# EAGLE design USBhost (EAGLE 5.11)
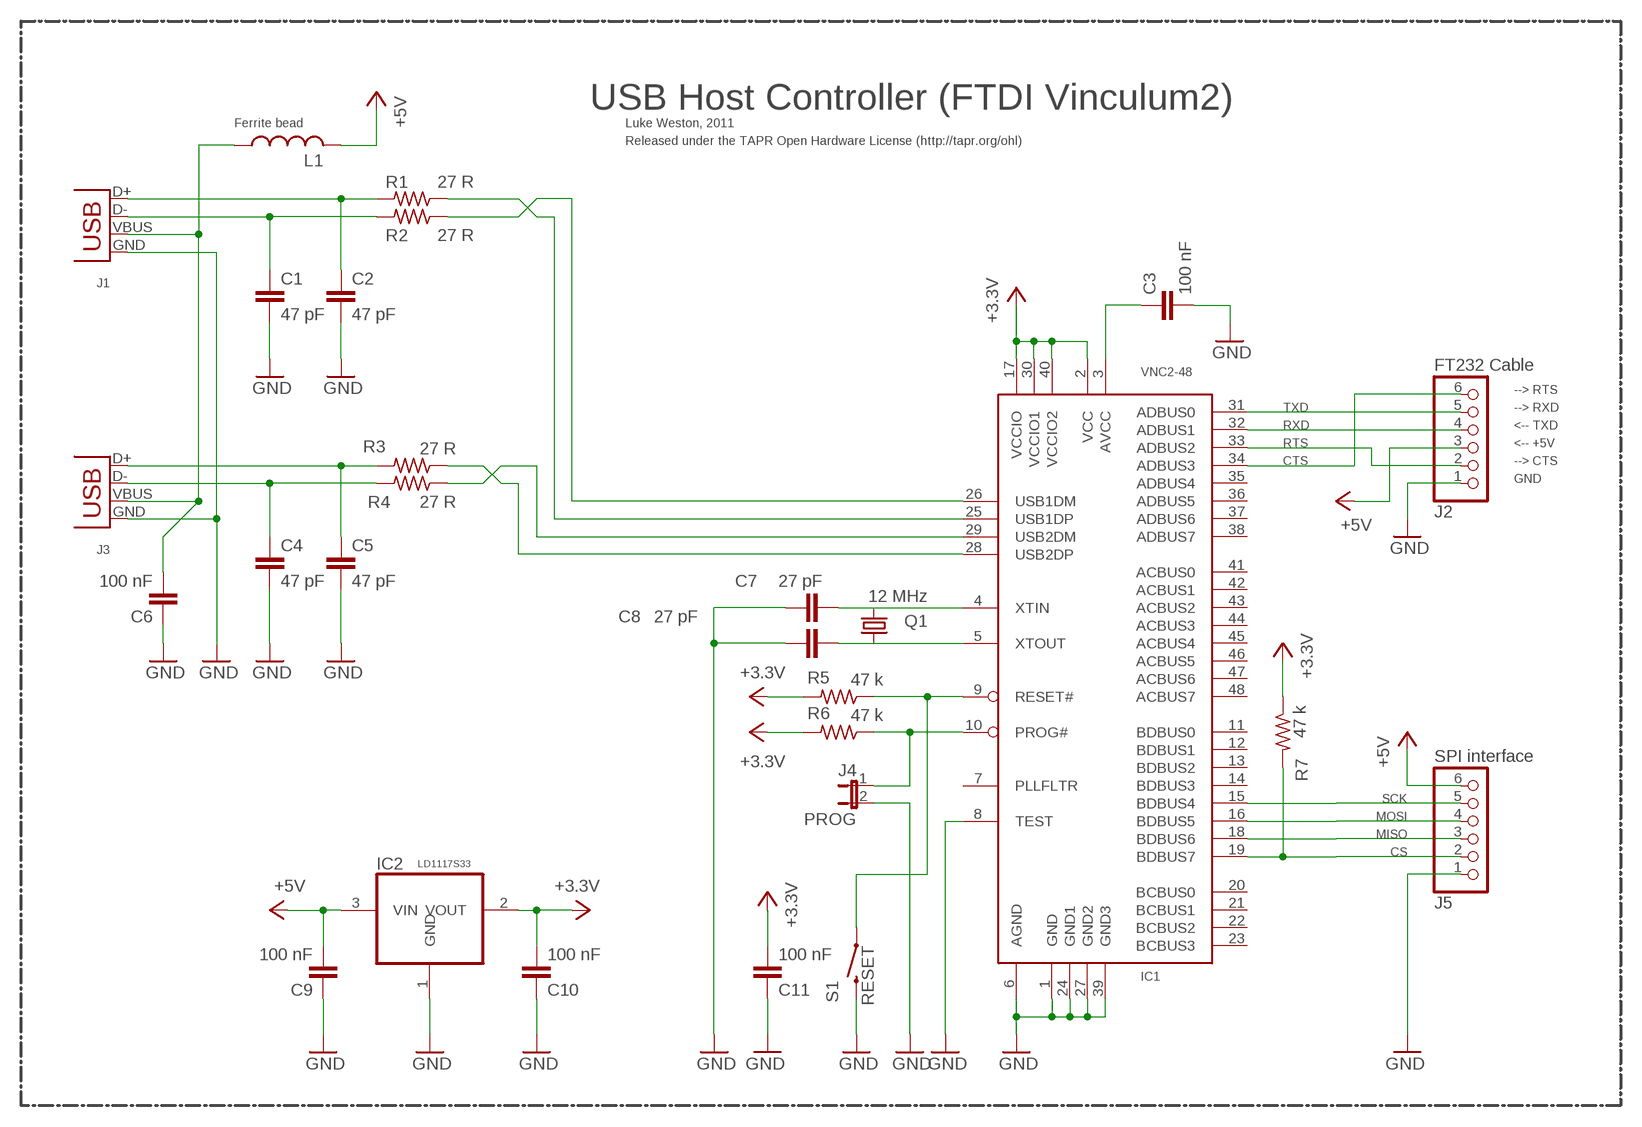
[diagram p0: schematic, sheet 1]

## Parts
C1  47 pF  C-EU025-024X044  [C025-024X044]
C2  47 pF  C-EU025-024X044  [C025-024X044]
C3  100 nF  C-EU025-024X044  [C025-024X044]
C4  47 pF  C-EU025-024X044  [C025-024X044]
C5  47 pF  C-EU025-024X044  [C025-024X044]
C6  100 nF  C-EU025-024X044  [C025-024X044]
C7  27 pF  C-EU025-024X044  [C025-024X044]
C8  27 pF  C-EU025-024X044  [C025-024X044]
C9  100 nF  C-EU025-024X044  [C025-024X044]
C10  100 nF  C-EU025-024X044  [C025-024X044]
C11  100 nF  C-EU025-024X044  [C025-024X044]
IC1  VNC2-48  VNC1L-1A  [LQFP48]
IC2  LD1117S33  REG1117  [SOT223]
J1  609-1041-ND  USB-A-HU  [USB-A-HU]
J2  FT232 Cable  PINHD-1X6  [1X06]
J3  609-1041-ND  USB-A-HU  [USB-A-HU]
J4  PROG  JP1E  [JP1]
J5  SPI interface  PINHD-1X6  [1X06]
L1  L-US0204/7  [0204/7]
Q1  12 MHz  CRYSTALHC49S  [HC49/S]
R1  27 R  R-US_0207/10  [0207/10]
R2  27 R  R-US_0207/10  [0207/10]
R3  27 R  R-US_0207/10  [0207/10]
R4  27 R  R-US_0207/10  [0207/10]
R5  47 k  R-US_0207/10  [0207/10]
R6  47 k  R-US_0207/10  [0207/10]
R7  47 k  R-US_0207/10  [0207/10]
S1  RESET  SWITCH-MOMENTARY-2PTH  [TACTILE-PTH]

## Nets
+3V3: C10.2 C11.2 IC1.2(VCC) IC1.17(VCCIO) IC1.30(VCCIO1) IC1.40(VCCIO2) IC2.2(VOUT) R5.2 R6.2 R7.1 ; supply symbol labelled +3.3V
+5V: C9.2 IC2.3(VIN) J2.3 J5.6 L1.2
/RESET: IC1.9(RESET#) R5.1 S1.1
/VNC_PROG: IC1.10(PROG#) J4.1 R6.1
CS: IC1.19(BDBUS7) J5.2 R7.2
CTS: IC1.34(ADBUS3) J2.6
GND: C1.2 C2.2 C3.2 C4.2 C5.2 C6.1 C7.2 C8.2 C9.1 C10.1 C11.1 IC1.1(GND) IC1.6(AGND) IC1.8(TEST) IC1.24(GND1) IC1.27(GND2) IC1.39(GND3) IC2.1(GND) J1.GND J2.1 J3.GND J4.2 J5.1 S1.3
MISO: IC1.18(BDBUS6) J5.3
MOSI: IC1.16(BDBUS5) J5.4
N$1: C3.1 IC1.3(AVCC)
N$2: C1.1 J1.D- R2.2
N$4: C2.1 J1.D+ R1.2
N$18: C4.1 J3.D- R4.2
N$19: C5.1 J3.D+ R3.2
N$22: IC1.29(USB2DM) R4.1
N$24: IC1.28(USB2DP) R3.1
N$25: IC1.25(USB1DP) R1.1
N$26: IC1.26(USB1DM) R2.1
N$44: C7.1 IC1.4(XTIN) Q1.2
N$45: C8.1 IC1.5(XTOUT) Q1.1
N$125: C6.2 J1.VBUS J3.VBUS L1.1
RTS: IC1.33(ADBUS2) J2.2
RXD: IC1.32(ADBUS1) J2.4
SCK: IC1.15(BDBUS4) J5.5
TXD: IC1.31(ADBUS0) J2.5
Unconnected: IC1.7(PLLFLTR) IC1.11(BDBUS0) IC1.12(BDBUS1) IC1.13(BDBUS2) IC1.14(BDBUS3) IC1.20(BCBUS0) IC1.21(BCBUS1) IC1.22(BCBUS2) IC1.23(BCBUS3) IC1.35(ADBUS4) IC1.36(ADBUS5) IC1.37(ADBUS6) IC1.38(ADBUS7) IC1.41(ACBUS0) IC1.42(ACBUS1) IC1.43(ACBUS2) IC1.44(ACBUS3) IC1.45(ACBUS4) IC1.46(ACBUS5) IC1.47(ACBUS6) IC1.48(ACBUS7)

## Notes on the sheet
- USB Host Controller (FTDI Vinculum2)
- Ferrite bead | Luke Weston, 2011
- Released under the TAPR Open Hardware License (http://tapr.org/ohl)
- --> RTS
- --> RXD
- <-- TXD
- <-- +5V
- --> CTS
- GND

## Library data of the parts
C1-C11 = rcl:C-EU: CAPACITOR, European symbol
IC1 = ftdichip-1:VNC1L
IC2 = burr-brown:REG1117: 800mA and 1A Low Dropout (LDO) Positive Regulator 1.8V, 2.5V, 2.85V, 3.3V, 5V, and Adj; MPN: REG1117; OC_FARNELL: 1097566; OC_NEWARK: 14P6981
J1 J3 = con-usb-3:USB: USB Connectors
J2 J5 = pinhead:PINHD-1X6: PIN HEADER
J4 = jumper:JP1E: JUMPER
L1 = rcl:L-US: INDUCTOR, American symbol
Q1 = crystal:CRYSTAL: CRYSTAL
R1-R7 = rcl:R-US_: RESISTOR, American symbol
S1 = SparkFun:SWITCH-MOMENTARY-2

## Board
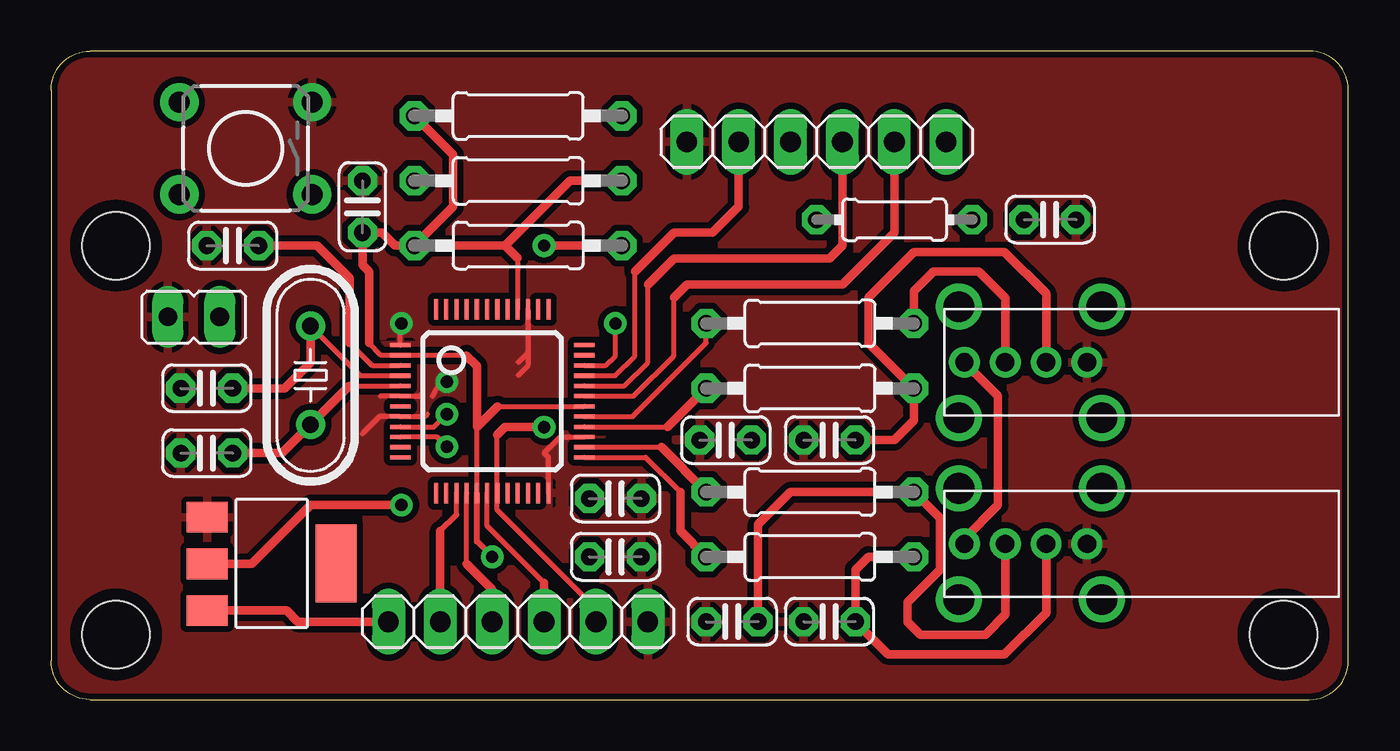
[diagram p1: board, top side]
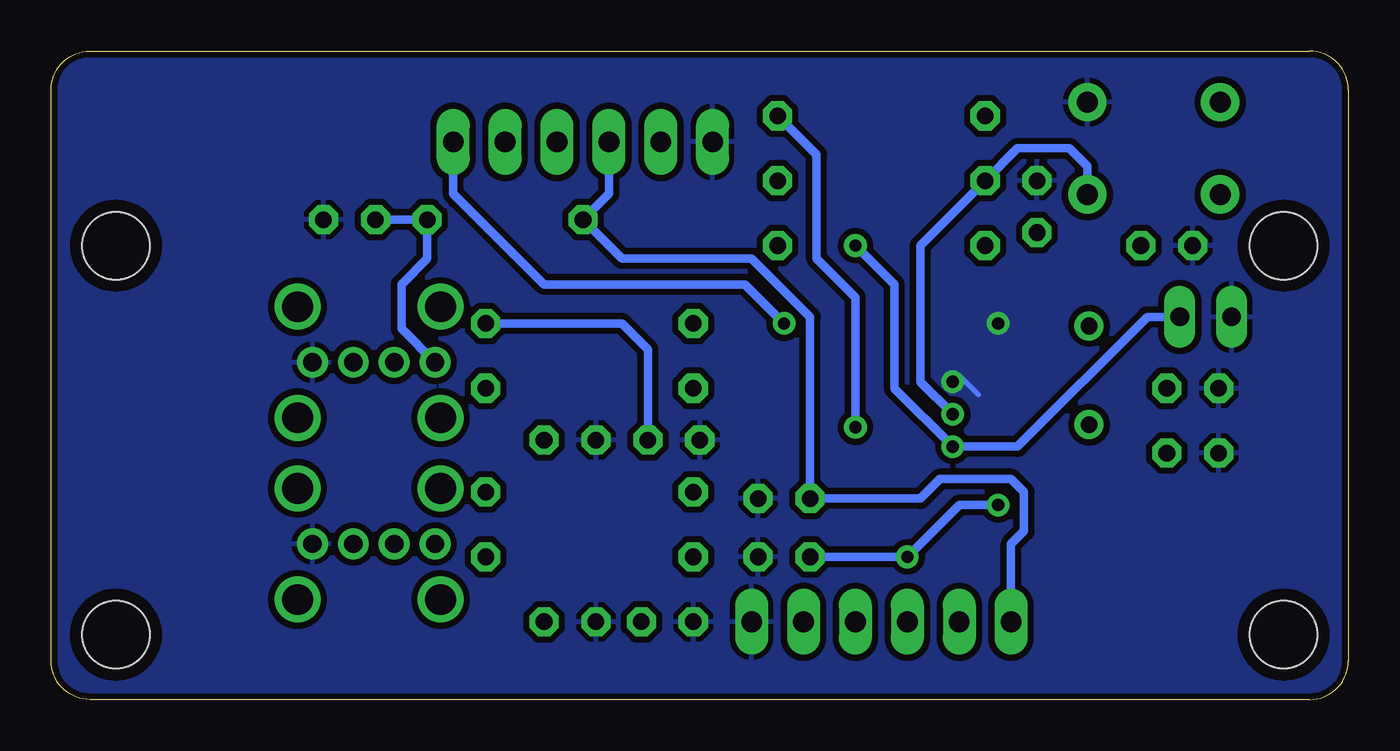
[diagram p2: board, bottom side, seen from below]

Size 63.5 x 31.75 mm. Coordinates in mm from the lower left corner, seen from the top.
Outline: 1.91,0 61.59,0 arc90 63.5,1.91 63.5,29.84 arc90 61.59,31.75 1.91,31.75 arc90 0,29.84 0,1.91 arc90 1.91,0
Copper layers (1*16): Top 0.035mm / dielectric 1.5mm / Bottom 0.035mm
Design rules "SparkFun.drc *": minimum track width 7mil, minimum drill 20mil, track to track 8mil, track to pad 8mil, pad to pad 8mil, via to via 8mil, smd to smd 8mil, copper to edge 10mil, drill to drill 8mil, minimum pad ring 12mil, minimum via ring 10mil, stop-mask expansion 4mil, vias tented up to drill 25mil, thermal gap 10mil

### Footprints (pad centres in the part's own frame; a part is rotated, then mirrored left to right if it is on the bottom)
C025-024X044 = drill 0.813 octagon: 1 -1.27,0; 2 1.27,0
LQFP48 = smd 0.2 x 1: 1 -2.75,-4.5; 2 -2.25,-4.5; 3 -1.75,-4.5; 4 -1.25,-4.5; 5 -0.75,-4.5; 6 -0.25,-4.5; 7 0.25,-4.5; 8 0.75,-4.5; 9 1.25,-4.5; 10 1.75,-4.5; 11 2.25,-4.5; 12 2.75,-4.5; 25 2.75,4.5; 26 2.25,4.5; 27 1.75,4.5; 28 1.25,4.5; 29 0.75,4.5; 30 0.25,4.5; 31 -0.25,4.5; 32 -0.75,4.5; 33 -1.25,4.5; 34 -1.75,4.5; 35 -2.25,4.5; 36 -2.75,4.5 | smd 1 x 0.2: 13 4.5,-2.75; 14 4.5,-2.25; 15 4.5,-1.75; 16 4.5,-1.25; 17 4.5,-0.75; 18 4.5,-0.25; 19 4.5,0.25; 20 4.5,0.75; 21 4.5,1.25; 22 4.5,1.75; 23 4.5,2.25; 24 4.5,2.75; 37 -4.5,2.75; 38 -4.5,2.25; 39 -4.5,1.75; 40 -4.5,1.25; 41 -4.5,0.75; 42 -4.5,0.25; 43 -4.5,-0.25; 44 -4.5,-0.75; 45 -4.5,-1.25; 46 -4.5,-1.75; 47 -4.5,-2.25; 48 -4.5,-2.75
SOT223 = smd 1.499 x 2.007: 1 -2.261,-3.15; 2 0.025,-3.15; 3 2.311,-3.15 | smd 3.81 x 2.007: 4 0,3.15
USB-A-HU = drill 0.9 round: D+ 2.73,0; D- 4.73,0; GND 0.73,0; VBUS 6.73,0 | drill 1.5 round: P$5 0,2.72; P$6 0,-2.72; P$7 7,2.72; P$8 7,-2.72
1X06 = drill 1.016 long: 1 -6.35,0; 2 -3.81,0; 3 -1.27,0; 4 1.27,0; 5 3.81,0; 6 6.35,0
JP1 = drill 0.914 long: 1 0,-1.27; 2 0,1.27
0204/7 = drill 0.813 octagon: 1 -3.81,0; 2 3.81,0
HC49/S = drill 0.813 round: 1 -2.413,0; 2 2.413,0
0207/10 = drill 0.813 octagon: 1 -5.08,0; 2 5.08,0
TACTILE-PTH = drill 1.016 pad 1.88 round: 1 -3.251,2.261; 2 3.251,2.261; 3 -3.251,-2.261; 4 3.251,-2.261
STAND-OFF = hole 3.302: 0,0

### Placement (x,y rotation side)
C1  33.34,3.81 180 top
C2  38.1,3.81 180 top
C3  8.89,22.23 180 top
C4  33.02,12.7 180 top
C5  38.1,12.7 180 top
C6  48.9,23.5 180 top
C7  7.62,15.24 180 top
C8  7.62,12.07 180 top
C9  27.62,9.84 180 top
C10  27.62,6.99 180 top
C11  15.24,24.13 270 top
IC1  21.59,14.61 270 top
IC2  10.8,6.67 270 top
J1  51.44,7.62 180 top
J2  37.47,27.3 0 top
J3  51.44,16.51 180 top
J4  6.99,18.73 90 top
J5  22.86,3.81 180 top
L1  41.28,23.5 180 top
Q1  12.7,15.88 90 top
R1  37.15,6.99 0 top
R2  37.15,10.16 0 top
R3  37.15,15.24 0 top
R4  37.15,18.41 0 top
R5  22.86,25.4 0 top
R6  22.86,22.23 180 top
R7  22.86,28.57 0 top
S1  9.52,26.99 180 top
U$2  [STAND-OFF]  3.17,3.17 0 top
U$3  [STAND-OFF]  3.17,22.23 0 top
U$4  [STAND-OFF]  60.33,3.17 0 top
U$5  [STAND-OFF]  60.33,22.23 0 top

### Tracks (layer width: path | path; a pad name or v marks a point on that pad's centre or on a via)
+3V3  (via drill 0.6 pad 0.25)
  Top 0.254: IC1.17 20.84,13.34 | 21.86,14.36 IC1.30 | 22.84,21.61 IC1.40 | 15.56,17.46 16.16,16.86 IC1.2 20.32,16.86
  Top 0.305: IC1.17 20.84,7.74 v21.59,6.99
  Top 0.406: 20.32,16.86 20.84,16.34 20.84,13.34 21.86,14.36 | R6.2 22.22,22.23 | 22.22,22.23 22.84,21.61 | R6.2 16.83,22.23 16.19,22.86 C11.2 15.24,21.27 15.56,20.96 15.56,17.46 | R5.2 25.4,25.4 22.22,22.23 | IC2.2 9.82,6.64 12.7,9.52 v17.14,9.52 | R7.1 19.68,26.67 19.68,24.13 R6.2
  Bottom 0.406: v17.14,9.52 19.05,9.52 v21.59,6.99 C10.2
+5V
  Top 0.406: IC2.3 11.52,4.36 12.07,3.81 J5.6
  Bottom 0.406: J5.6 16.51,7.62 15.88,8.25 15.88,10.16 16.51,10.8 20,10.8 20.95,9.84 C9.2 26.35,18.73 29.21,21.59 35.56,21.59 L1.2 36.2,24.77 J2.3
/RESET  (via drill 0.6 pad 0.25)
  Top 0.254: IC1.9 18.75,13.36 v19.37,13.97
  Bottom 0.406: v19.37,13.97 20.95,15.56 20.95,22.23 R5.1 16.19,26.99 13.65,26.99 12.78,26.11 S1.1
/VNC_PROG  (via drill 0.6 pad 0.25)
  Top 0.254: IC1.10 18.89,12.86 v19.37,12.38
  Top 0.406: v24.13,22.23 R6.1
  Bottom 0.406: v24.13,22.23 22.22,20.32 22.22,15.24 v19.37,12.38 16.19,12.38 9.84,18.73 J4.1
CS  (via drill 0.6 pad 0.25)
  Top 0.254: J5.2 26.67,4.45 21.84,9.27 IC1.19 21.84,12.95
  Top 0.406: 21.84,12.95 22.22,13.34 v24.13,13.34
  Bottom 0.406: v24.13,13.34 24.13,19.69 26.04,21.59 26.04,26.67 R7.2
CTS  (via drill 0.6 pad 0.25)
  Top 0.254: IC1.34 27.15,16.36 27.62,16.83 v27.62,18.41
  Bottom 0.406: v27.62,18.41 29.53,20.32 39.37,20.32 43.82,24.77 J2.6
GND  (via drill 0.6 pad 0.25)
  Top 0.254: IC1.24 24.34,11.86 24.13,12.07 24.92,12.86 IC1.27 | 22.86,15.88 23.34,16.36 IC1.39 23.34,16.99 22.86,16.51 | 18.66,14.86 19.05,15.56 v19.37,15.56 | IC1.1 17.09,18.36 v17.14,18.41 | 16.12,14.86 IC1.6 18.03,14.86 18.1,14.92 | 18.41,13.97 18.3,13.86 IC1.8 16.08,13.86 15.24,13.02
  Bottom 0.254: v19.37,15.56 19.68,15.88 19.05,15.88 18.1,14.92
  pour Top (isolate 0.305): -1.9,33.66 65.41,33.66 65.41,-1.27 -1.9,-1.27
  pour Bottom (isolate 0.305): -1.9,33.66 65.41,33.66 65.41,-1.27 -1.9,-1.27
MISO
  Top 0.254: IC1.18 21.34,8.5 24.13,5.72
  Top 0.406: J5.3 24.13,5.72
MOSI
  Top 0.254: 20.34,6.65 IC1.16
  Top 0.406: 20.34,6.65 21.59,5.4 J5.4
N$1
  Top 0.254: IC1.3 15.71,16.36 14.61,17.46
  Top 0.406: 14.61,17.46 14.61,20.64 13.02,22.23 C3.1
N$2
  Top 0.406: J1.D- 46.71,4.16 45.72,3.17 42.55,3.17 41.91,3.81 41.91,4.76 43.5,6.35 43.5,8.89 R2.2 36.2,10.16 34.61,8.57 C1.1
N$4
  Top 0.406: J1.D+ 48.71,4.25 46.67,2.22 40.96,2.22 C2.1 39.37,6.35 40.01,6.99 R1.2
N$18
  Top 0.406: J3.D- 46.71,19.65 45.4,20.96 43.18,20.96 42.23,20 R4.2
  Bottom 0.406: R4.2 35.56,18.41 34.29,17.14 C4.1
N$19
  Top 0.406: J3.D+ 48.71,19.88 46.67,21.91 42.23,21.91 40.01,19.69 40.01,17.46 R3.2 42.23,13.65 41.28,12.7 C5.1
N$22
  Top 0.254: IC1.29 28.46,13.86 32.07,17.46 R4.1
N$24
  Top 0.254: IC1.28 30.18,13.36
  Top 0.406: 30.18,13.36 R3.1
N$25
  Top 0.254: IC1.25 29.1,11.86 30.8,10.16
  Top 0.406: 30.8,10.16 30.8,8.25 R1.1
N$26
  Top 0.254: IC1.26 29.87,12.36
  Top 0.406: 29.87,12.36 R2.1
N$44
  Top 0.254: IC1.4 15.13,15.86 Q1.2
  Top 0.406: C7.1 11.43,15.24 12.7,16.51 Q1.2
N$45
  Top 0.254: 14.59,15.36 IC1.5
  Top 0.406: 14.59,15.36 Q1.1 11.3,12.07 C8.1
N$125
  Top 0.406: J3.VBUS 46.36,14.86 46.36,9.52 44.71,7.87 J1.VBUS
  Bottom 0.406: J3.VBUS 46.36,18.16 46.36,20.32 45.09,21.59 L1.1 C6.2
RTS
  Top 0.254: IC1.33 27.6,15.86 28.57,16.83 28.57,20.96
  Top 0.406: J2.2 33.66,24.13 32.39,22.86 30.48,22.86 28.57,20.96
RXD
  Top 0.254: IC1.32 28.05,15.36 29.21,16.51 29.21,20.32
  Top 0.406: J2.4 38.73,22.23 38.1,21.59 30.48,21.59 29.21,20.32
SCK
  Top 0.254: 19.84,9.05 IC1.15
  Top 0.305: 19.05,8.25 19.84,9.05
  Top 0.406: J5.5 19.05,8.25
TXD
  Top 0.254: 30.48,19.69 30.48,16.83 28.51,14.86 IC1.31
  Top 0.406: J2.5 41.28,22.86 38.73,20.32 31.11,20.32 30.48,19.69

### Text on the board
Document: GND | RTS | +5V | RXD | TXD | CTS | SERIAL INTERFACE | SUPPLY VOLTAGE = 5 V | USE STANDARD FTDI CABLE | 3.3 V LOGIC LEVELS (5V TOLERANT) | BEAD | USB 2 | USB 1 | Vinculum2 USB Host Controller | SPI Interface: | +5V | SCK | MOSI | MISO | /CS | GND | Breakout Development Board | Luke Weston, 2011
Reference: RESET